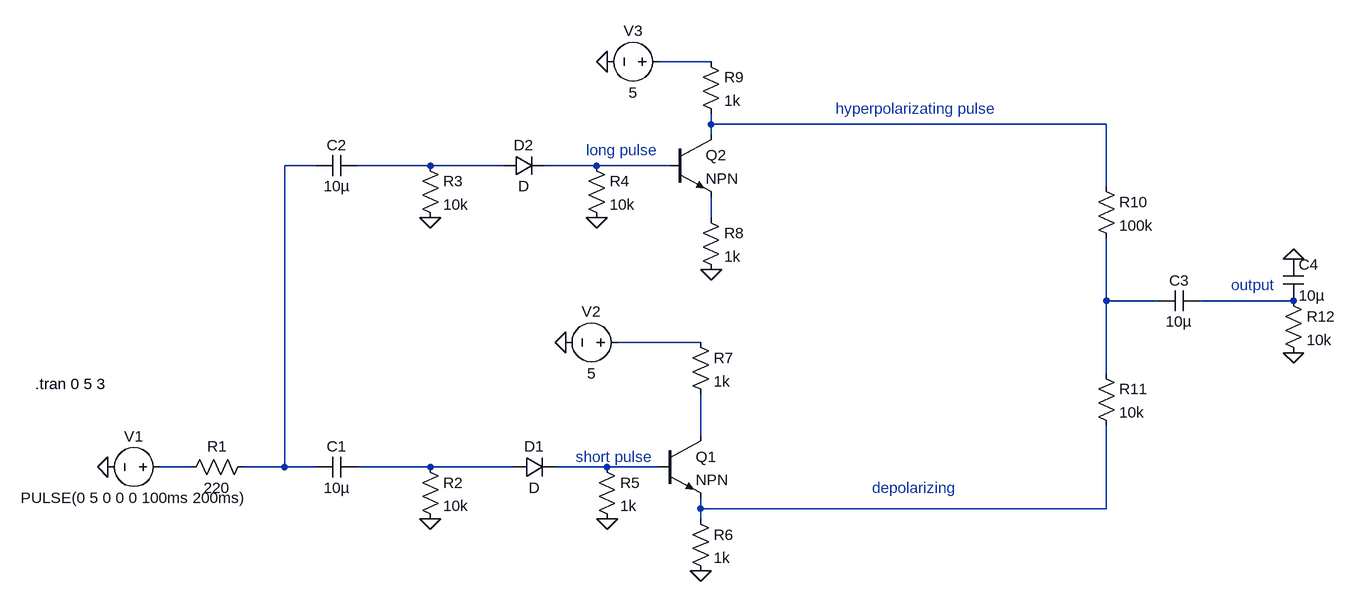
[diagram p0: schematic NeuroSim.asc]
NeuroSim.asc, the LTspice schematic file:
Version 4
SHEET 1 1860 680
WIRE 896 -368 816 -368
WIRE 896 -272 896 -288
WIRE 1504 -272 896 -272
WIRE 896 -256 896 -272
WIRE 288 -208 240 -208
WIRE 464 -208 352 -208
WIRE 576 -208 464 -208
WIRE 720 -208 640 -208
WIRE 832 -208 720 -208
WIRE 1504 -176 1504 -272
WIRE 896 -128 896 -160
WIRE 1504 0 1504 -96
WIRE 1584 0 1504 0
WIRE 1792 0 1648 0
WIRE 880 64 752 64
WIRE 1504 112 1504 0
WIRE 880 208 880 144
WIRE 96 256 48 256
WIRE 240 256 240 -208
WIRE 240 256 176 256
WIRE 288 256 240 256
WIRE 464 256 352 256
WIRE 592 256 464 256
WIRE 736 256 656 256
WIRE 816 256 736 256
WIRE 880 320 880 304
WIRE 1504 320 1504 192
WIRE 1504 320 880 320
WIRE 880 336 880 320
FLAG -32 256 0
FLAG 464 -128 0
FLAG 720 -128 0
FLAG 464 336 0
FLAG 736 336 0
FLAG 672 64 0
FLAG 880 416 0
FLAG 896 -48 0
FLAG 736 -368 0
FLAG 1792 -64 0
FLAG 1792 80 0
SYMBOL voltage 64 256 R90
WINDOW 0 -32 56 VBottom 2
WINDOW 3 32 56 VTop 2
WINDOW 123 0 0 Left 0
WINDOW 39 0 0 Left 0
SYMATTR InstName V1
SYMATTR Value PULSE(0 5 0 0 0 100ms 200ms)
SYMBOL res 80 272 R270
WINDOW 0 32 56 VTop 2
WINDOW 3 0 56 VBottom 2
SYMATTR InstName R1
SYMATTR Value 220
SYMBOL cap 352 240 R90
WINDOW 0 0 32 VBottom 2
WINDOW 3 32 32 VTop 2
SYMATTR InstName C1
SYMATTR Value 10µ
SYMBOL res 448 240 R0
SYMATTR InstName R2
SYMATTR Value 10k
SYMBOL diode 592 272 R270
WINDOW 0 32 32 VTop 2
WINDOW 3 0 32 VBottom 2
SYMATTR InstName D1
SYMBOL cap 352 -224 R90
WINDOW 0 0 32 VBottom 2
WINDOW 3 32 32 VTop 2
SYMATTR InstName C2
SYMATTR Value 10µ
SYMBOL res 448 -224 R0
SYMATTR InstName R3
SYMATTR Value 10k
SYMBOL res 704 -224 R0
SYMATTR InstName R4
SYMATTR Value 10k
SYMBOL diode 576 -192 R270
WINDOW 0 32 32 VTop 2
WINDOW 3 0 32 VBottom 2
SYMATTR InstName D2
SYMBOL res 720 240 R0
SYMATTR InstName R5
SYMATTR Value 1k
SYMBOL voltage 768 64 R90
WINDOW 0 -32 56 VBottom 2
WINDOW 3 32 56 VTop 2
WINDOW 123 0 0 Left 0
WINDOW 39 0 0 Left 0
SYMATTR InstName V2
SYMATTR Value 5
SYMBOL npn 816 208 R0
SYMATTR InstName Q1
SYMBOL npn 832 -256 R0
SYMATTR InstName Q2
SYMBOL res 864 320 R0
SYMATTR InstName R6
SYMATTR Value 1k
SYMBOL res 864 48 R0
SYMATTR InstName R7
SYMATTR Value 1k
SYMBOL res 880 -144 R0
SYMATTR InstName R8
SYMATTR Value 1k
SYMBOL res 880 -384 R0
SYMATTR InstName R9
SYMATTR Value 1k
SYMBOL voltage 832 -368 R90
WINDOW 0 -32 56 VBottom 2
WINDOW 3 32 56 VTop 2
WINDOW 123 0 0 Left 0
WINDOW 39 0 0 Left 0
SYMATTR InstName V3
SYMATTR Value 5
SYMBOL res 1488 -192 R0
SYMATTR InstName R10
SYMATTR Value 100k
SYMBOL res 1488 96 R0
SYMATTR InstName R11
SYMATTR Value 10k
SYMBOL res 1776 -16 R0
SYMATTR InstName R12
SYMATTR Value 10k
SYMBOL cap 1776 -64 R0
SYMATTR InstName C4
SYMATTR Value 10µ
SYMBOL cap 1648 -16 R90
WINDOW 0 0 32 VBottom 2
WINDOW 3 32 32 VTop 2
SYMATTR InstName C3
SYMATTR Value 10µ
TEXT -144 128 Left 2 !.tran 0 5 3
TEXT 1088 -296 Left 2 ;hyperpolarizating pulse
TEXT 1144 288 Left 2 ;depolarizing
TEXT 688 240 Left 2 ;short pulse
TEXT 704 -232 Left 2 ;long pulse
TEXT 1696 -24 Left 2 ;output

The netlist it stands for:
* NeuroSim.asc
V1 N011 0 PULSE(0 5 0 0 0 100ms 200ms)
R1 N011 N003 220
C1 N012 N003 10µ
R2 N012 0 10k
D1 N012 N013 D
C2 N004 N003 10µ
R3 N004 0 10k
R4 N005 0 10k
D2 N004 N005 D
R5 N013 0 1k
V2 N009 0 5
Q1 N010 N013 N014 0 NPN
Q2 N002 N005 N006 0 NPN
R6 N014 0 1k
R7 N009 N010 1k
R8 N006 0 1k
R9 N001 N002 1k
V3 N001 0 5
R10 N002 N007 100k
R11 N007 N014 10k
R12 N008 0 10k
C4 0 N008 10µ
C3 N008 N007 10µ
.model D D
.lib standard.dio
.model NPN NPN
.model PNP PNP
.lib standard.bjt
.tran 0 5 3
* hyperpolarizating pulse
* depolarizing
* short pulse
* long pulse
* output
.backanno
.end